# EAGLE design 004-floorSensor (EAGLE 9.6.2)
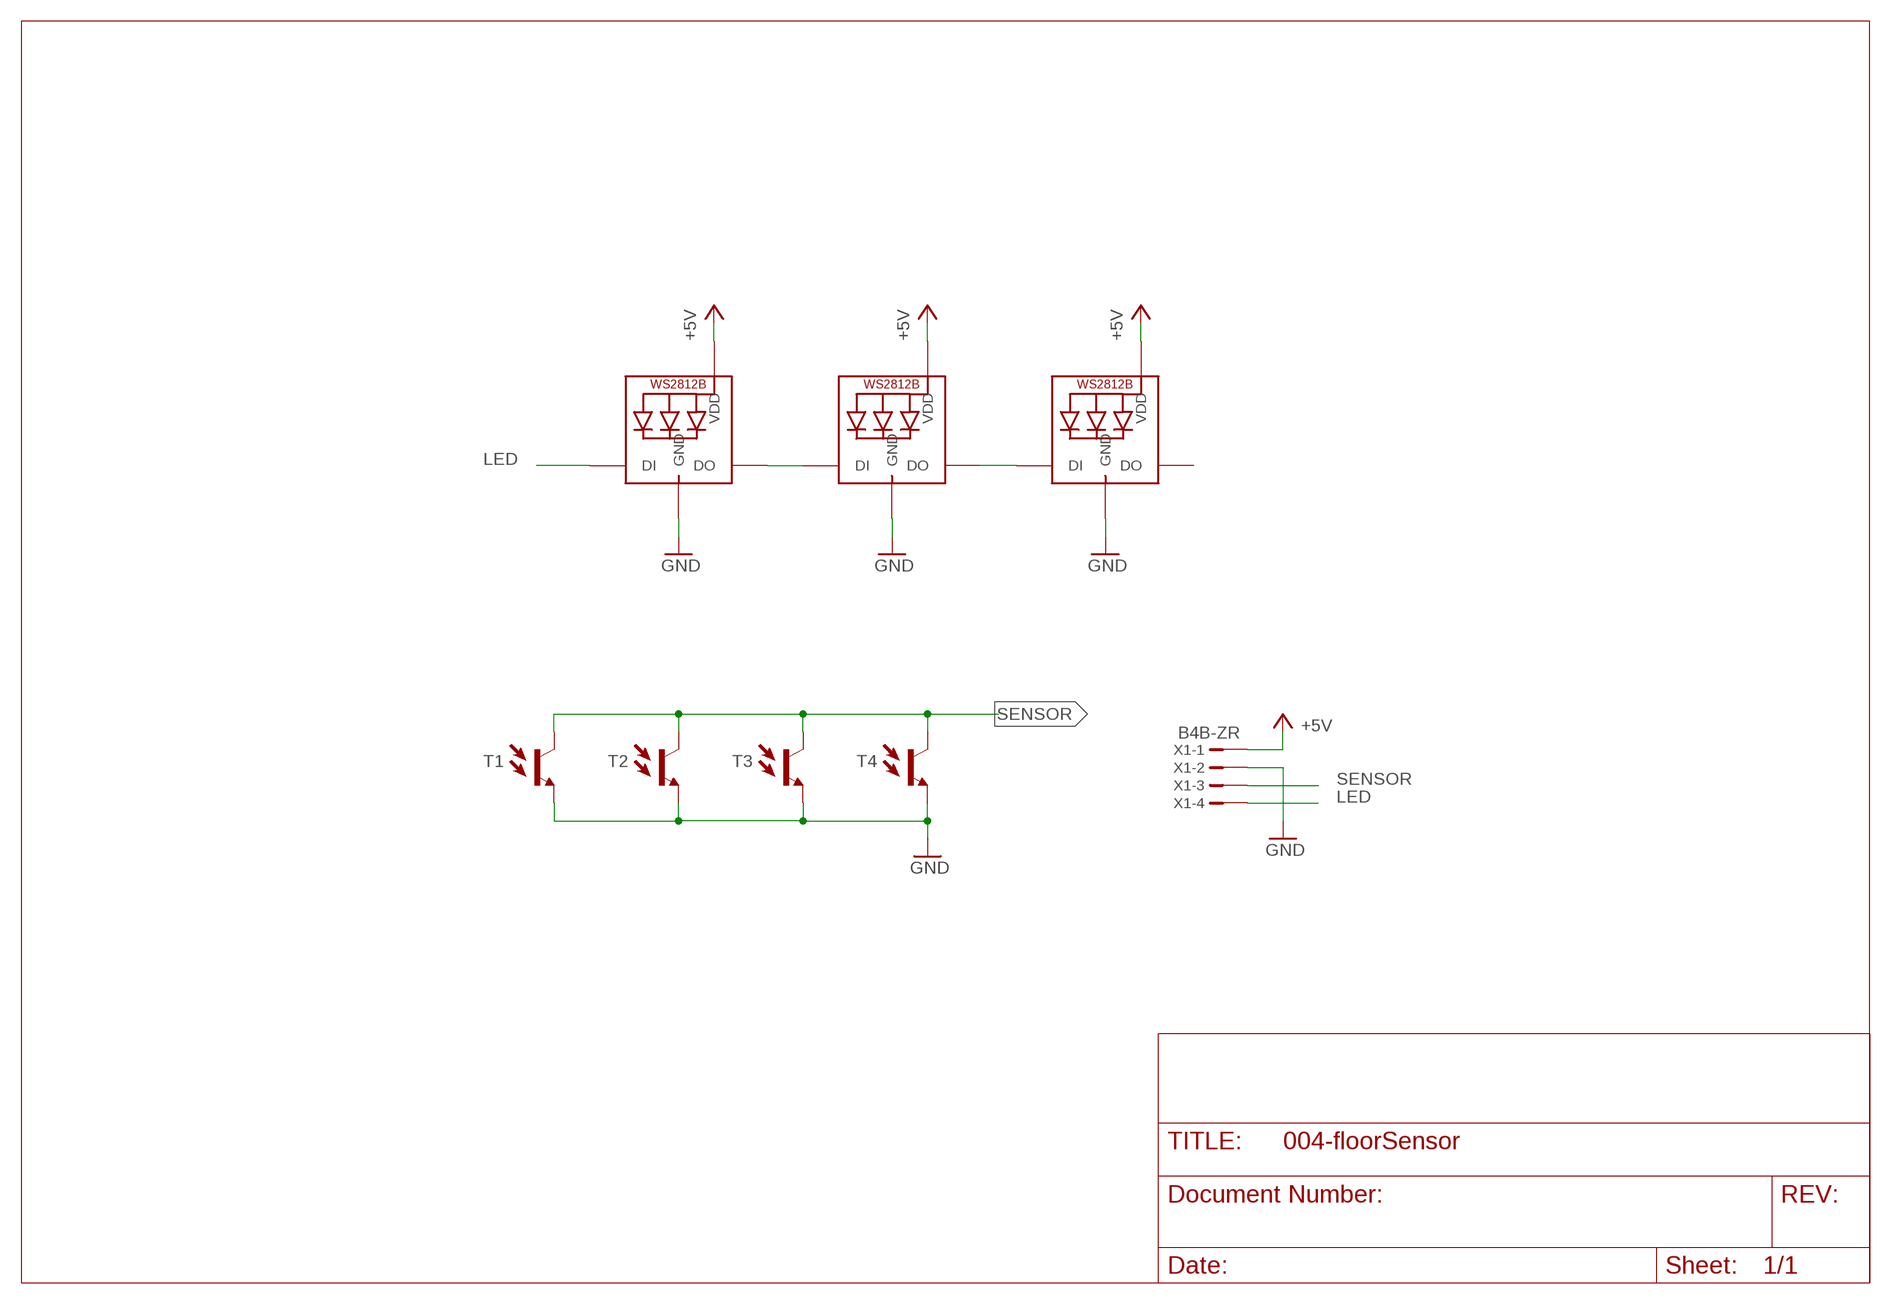
[diagram p0: schematic, sheet 1]

## Parts
LED1  WS2812B_5050N  [WS2812B-NARROW]
LED2  WS2812B_5050N  [WS2812B-NARROW]
LED3  WS2812B_5050N  [WS2812B-NARROW]
T1  MYPARTS_NJL7502L  [MYPARTS_NJL7502L]
T2  MYPARTS_NJL7502L  [MYPARTS_NJL7502L]
T3  MYPARTS_NJL7502L  [MYPARTS_NJL7502L]
T4  MYPARTS_NJL7502L  [MYPARTS_NJL7502L]
X1  B4B-ZR  [B4B-ZR]

## Nets
+5V: LED1.1-VDD(VDD) LED2.1-VDD(VDD) LED3.1-VDD(VDD) X1.1
GND: LED1.3-GND(GND) LED2.3-GND(GND) LED3.3-GND(GND) T1.E T2.E T3.E T4.E X1.2
LED: LED1.4-DIN(DI) X1.4
N$1: LED1.2-DOUT(DO) LED2.4-DIN(DI)
N$3: LED2.2-DOUT(DO) LED3.4-DIN(DI)
SENSOR: T1.C T2.C T3.C T4.C X1.3
Unconnected: LED3.2-DOUT(DO)

## Library data of the parts
LED1-LED3 = microbuilder:WS2812B
T1-T4 = #001-line:MYPARTS_NJL7502L
X1 = con-jst:?4B-ZR: ZH CONNECTOR 1.5 mm, 4 pin 1 row Source: http://www.jst.com .. eZH.pdf; MF: FARNELL; MPN: B4B-ZR(LF)(SN); OC_FARNELL: 1830916; OC_NEWARK: 37K9960

## Net classes
0 default: width 0.406 mm

## Board
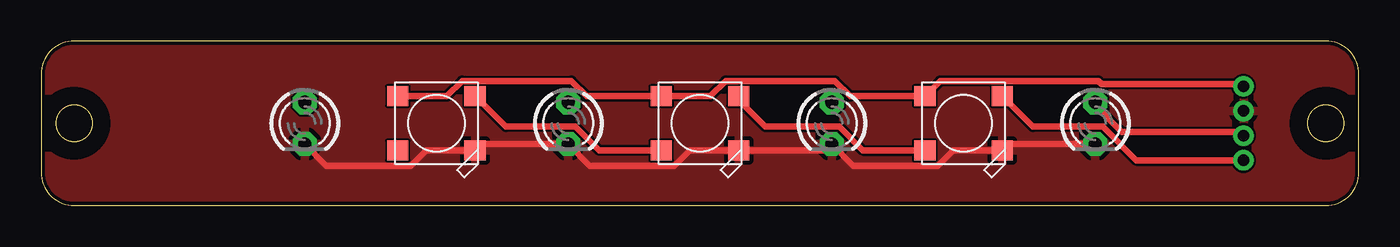
[diagram p1: board, top side]
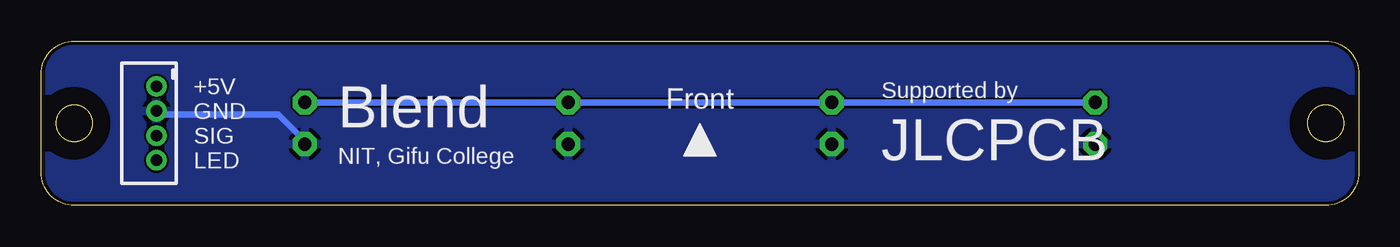
[diagram p2: board, bottom side, seen from below]

Size 80 x 10 mm. Coordinates in mm from the lower left corner, seen from the top.
Outline: 78,10 2,10 arc90 0,8 0,2 arc90 2,0 78,0 arc90 80,2 80,8 arc90 78,10
Outline: circle at 2,5 radius 1.1
Outline: circle at 78,5 radius 1.1
Copper layers (1*16): Top 0.035mm / dielectric 1.6mm / Bottom 0.035mm
Design rules "jlcpcb-2layers": minimum track width 5mil, minimum drill 0.3mm, track to track 5mil, track to pad 5mil, pad to pad 5mil, via to via 5mil, smd to smd 5mil, copper to edge 0.2mm, drill to drill 6mil, minimum pad ring 10mil, minimum via ring 3mil, stop-mask expansion 4mil, vias tented up to drill 0mil, thermal gap 10mil
tRestrict: area 76,3 to 80,7; area 0,3 to 4,7
bRestrict: area 76,3 to 80,7; area 0,3 to 4,7

### Footprints (pad centres in the part's own frame; a part is rotated, then mirrored left to right if it is on the bottom)
WS2812B-NARROW = smd 1.3 x 1.2: 1-VDD 2.35,-1.65; 2-DOUT 2.35,1.65; 3-GND -2.35,1.65; 4-DIN -2.35,-1.65
MYPARTS_NJL7502L = drill 0.813 octagon: C -1.27,0; E 1.27,0
B4B-ZR = drill 0.7 pad 1.1: 1 -2.25,0; 2 -0.75,0; 3 0.75,0; 4 2.25,0

### Placement (x,y rotation side)
LED1  56,5 180 top
LED2  40,5 180 top
LED3  24,5 180 top
T1  16,5 270 top
T2  32,5 270 top
T3  48,5 270 top
T4  64,5 270 top
X1  73,5 270 bottom

### Tracks (layer width: path | path; a pad name or v marks a point on that pad's centre or on a via)
+5V
  Top 0.406: LED3.1-VDD 24.63,6.65 25.56,7.58 32.19,7.58 33.12,6.65 LED2.1-VDD 40.63,6.65 41.56,7.58 48.19,7.58 49.12,6.65 LED1.1-VDD 54.58,7.58 64.19,7.58 64.39,7.39 72.86,7.39 X1.1
GND
  Top 0.406: T4.E 58.73,3.73 LED1.3-GND 55.37,3.35 54.44,2.42 49.31,2.42 T3.E 47.62,3.35 LED2.3-GND 39.37,3.35 38.44,2.42 33.31,2.42 T2.E 26.73,3.73 LED3.3-GND 23.37,3.35 22.44,2.42 17.31,2.42 T1.E
  Bottom 0.406: X1.2 72.8,5.53 65.6,5.53 64,3.93 T4.E
  pour Top: 80,10 80,0 0,0 0,10
  pour Bottom: 80,10 80,0 0,0 0,10
LED
  Top 0.406: LED1.4-DIN 60.21,4.79 64.44,4.79 66.48,2.75 X1.4
N$1
  Top 0.406: LED1.2-DOUT 49.88,3.35 48.44,4.79 43.98,4.79 42.35,6.42 LED2.4-DIN
N$3
  Top 0.406: LED2.2-DOUT 33.88,3.35 32.44,4.79 28.21,4.79 LED3.4-DIN
SENSOR
  Top 0.406: X1.3 72.8,4.47 65.6,4.47 64,6.07 T4.C
  Bottom 0.406: T4.C T3.C T2.C T1.C

### Text on the board
bPlace: Supported by | Front | +5V | Blend | GND | JLCPCB | SIG | NIT, Gifu College | LED